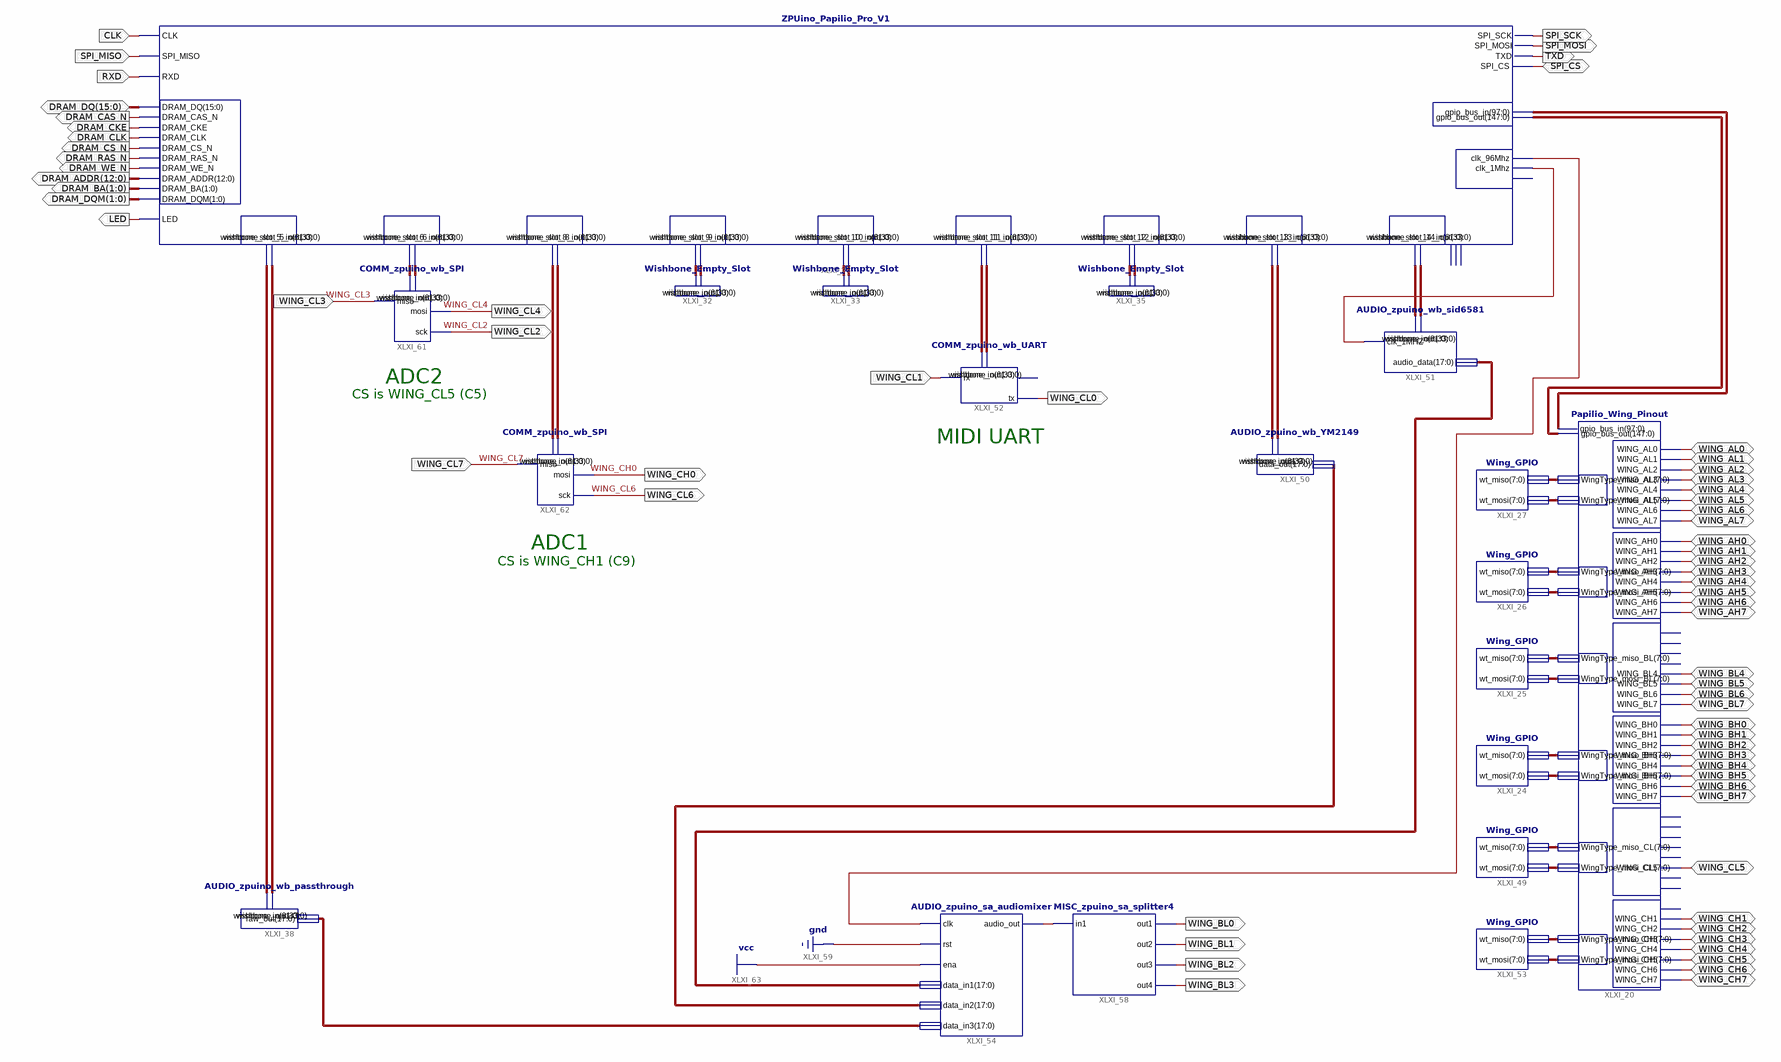
[diagram p0: schematic sheet 1]
// Xilinx ISE schematic Papilio_Pro.sch (spartan6) as structural Verilog: 19 symbols, 66 ports
module Papilio_Pro (
  input  WING_CL3,
  input  WING_CL7,
  input  RXD,
  input  SPI_MISO,
  input  CLK,
  input  WING_CL1,
  inout  WING_AL0,
  inout  WING_AL1,
  inout  WING_AL2,
  inout  WING_AL3,
  inout  WING_AL4,
  inout  WING_AL5,
  inout  WING_AL6,
  inout  WING_AL7,
  inout  WING_AH0,
  inout  WING_AH1,
  inout  WING_AH2,
  inout  WING_AH3,
  inout  WING_AH4,
  inout  WING_AH5,
  inout  WING_AH6,
  inout  WING_AH7,
  inout  WING_BL4,
  inout  WING_BL5,
  inout  WING_BL6,
  inout  WING_BL7,
  inout  WING_BH0,
  inout  WING_BH1,
  inout  WING_BH2,
  inout  WING_BH3,
  inout  WING_BH4,
  inout  WING_BH5,
  inout  WING_BH6,
  inout  WING_BH7,
  inout  WING_CL5,
  inout  WING_CH1,
  inout  WING_CH2,
  inout  WING_CH3,
  inout  WING_CH4,
  inout  WING_CH5,
  inout  WING_CH6,
  inout  WING_CH7,
  inout  [15:0] DRAM_DQ,
  inout  SPI_CS,
  output WING_CL2,
  output WING_CL4,
  output WING_CL6,
  output WING_CH0,
  output DRAM_CAS_N,
  output DRAM_CKE,
  output DRAM_CLK,
  output DRAM_CS_N,
  output DRAM_RAS_N,
  output DRAM_WE_N,
  output [12:0] DRAM_ADDR,
  output [1:0] DRAM_BA,
  output [1:0] DRAM_DQM,
  output LED,
  output TXD,
  output SPI_MOSI,
  output SPI_SCK,
  output WING_CL0,
  output WING_BL0,
  output WING_BL1,
  output WING_BL2,
  output WING_BL3
);

  wire XLXN_504, XLXN_509, XLXN_511;
  wire [7:0] XLXN_329, XLXN_330, XLXN_331, XLXN_332, XLXN_333, XLXN_334, XLXN_335, XLXN_336, XLXN_453,
       XLXN_454, XLXN_471, XLXN_472;
  wire [17:0] XLXN_484, XLXN_514, XLXN_515;
  wire [33:0] XLXN_435, XLXN_439, XLXN_441, XLXN_449, XLXN_474, XLXN_476, XLXN_478, XLXN_518, XLXN_520;
  wire [61:0] XLXN_434, XLXN_438, XLXN_440, XLXN_448, XLXN_473, XLXN_475, XLXN_477, XLXN_517, XLXN_519;
  wire [97:0] XLXN_409;
  wire [147:0] XLXN_408;

  ZPUino_Papilio_Pro_V1 XLXI_28 (
    .gpio_bus_out(XLXN_408), .gpio_bus_in(XLXN_409), .SPI_CS(SPI_CS), .TXD(TXD), .SPI_MOSI(SPI_MOSI),
    .SPI_SCK(SPI_SCK), .clk_96Mhz(XLXN_511), .clk_1Mhz(XLXN_509), .DRAM_DQ(DRAM_DQ), .LED(LED),
    .DRAM_CAS_N(DRAM_CAS_N), .DRAM_CKE(DRAM_CKE), .DRAM_CLK(DRAM_CLK), .DRAM_CS_N(DRAM_CS_N),
    .DRAM_RAS_N(DRAM_RAS_N), .DRAM_WE_N(DRAM_WE_N), .DRAM_ADDR(DRAM_ADDR), .DRAM_BA(DRAM_BA),
    .DRAM_DQM(DRAM_DQM), .CLK(CLK), .SPI_MISO(SPI_MISO), .RXD(RXD), .wishbone_slot_5_out(XLXN_449),
    .wishbone_slot_5_in(XLXN_448), .wishbone_slot_6_in(XLXN_517), .wishbone_slot_6_out(XLXN_518),
    .wishbone_slot_8_in(XLXN_519), .wishbone_slot_8_out(XLXN_520), .wishbone_slot_9_in(XLXN_440),
    .wishbone_slot_9_out(XLXN_441), .wishbone_slot_10_in(XLXN_438), .wishbone_slot_10_out(XLXN_439),
    .wishbone_slot_11_in(XLXN_477), .wishbone_slot_11_out(XLXN_478), .wishbone_slot_12_in(XLXN_434),
    .wishbone_slot_12_out(XLXN_435), .wishbone_slot_13_in(XLXN_473), .wishbone_slot_13_out(XLXN_474),
    .wishbone_slot_14_in(XLXN_475), .wishbone_slot_14_out(XLXN_476));  // open: clk_osc_32Mhz, wishbone_slot_video_in, wishbone_slot_video_out, vgaclkout
  Wishbone_Empty_Slot XLXI_35 (.wishbone_in(XLXN_434), .wishbone_out(XLXN_435));
  Wishbone_Empty_Slot XLXI_33 (.wishbone_in(XLXN_438), .wishbone_out(XLXN_439));
  Wishbone_Empty_Slot XLXI_32 (.wishbone_in(XLXN_440), .wishbone_out(XLXN_441));
  AUDIO_zpuino_wb_passthrough XLXI_38 (.raw_out(XLXN_484), .wishbone_in(XLXN_448), .wishbone_out(XLXN_449));
  AUDIO_zpuino_wb_YM2149 XLXI_50 (.data_out(XLXN_515), .wishbone_in(XLXN_473), .wishbone_out(XLXN_474));
  AUDIO_zpuino_wb_sid6581 XLXI_51 (
    .clk_1MHZ(XLXN_509), .audio_data(XLXN_514), .wishbone_in(XLXN_475), .wishbone_out(XLXN_476));
  COMM_zpuino_wb_UART XLXI_52 (
    .rx(WING_CL1), .wishbone_in(XLXN_477), .wishbone_out(XLXN_478), .tx(WING_CL0));  // open: enabled
  Wing_GPIO XLXI_49 (.wt_miso(XLXN_471), .wt_mosi(XLXN_472));
  Wing_GPIO XLXI_27 (.wt_miso(XLXN_335), .wt_mosi(XLXN_336));
  Wing_GPIO XLXI_26 (.wt_miso(XLXN_333), .wt_mosi(XLXN_334));
  Wing_GPIO XLXI_25 (.wt_miso(XLXN_331), .wt_mosi(XLXN_332));
  Wing_GPIO XLXI_24 (.wt_miso(XLXN_329), .wt_mosi(XLXN_330));
  Papilio_Wing_Pinout XLXI_20 (
    .gpio_bus_out(XLXN_408), .gpio_bus_in(XLXN_409), .WING_AH0(WING_AH0), .WING_AH1(WING_AH1),
    .WING_AH2(WING_AH2), .WING_AH3(WING_AH3), .WING_AH4(WING_AH4), .WING_AH5(WING_AH5), .WING_AH6(WING_AH6),
    .WING_AH7(WING_AH7), .WING_AL0(WING_AL0), .WING_AL1(WING_AL1), .WING_AL2(WING_AL2), .WING_AL3(WING_AL3),
    .WING_AL4(WING_AL4), .WING_AL5(WING_AL5), .WING_AL6(WING_AL6), .WING_AL7(WING_AL7), .WING_BH0(WING_BH0),
    .WING_BH1(WING_BH1), .WING_BH2(WING_BH2), .WING_BH3(WING_BH3), .WING_BH4(WING_BH4), .WING_BH5(WING_BH5),
    .WING_BH6(WING_BH6), .WING_BH7(WING_BH7), .WING_BL4(WING_BL4), .WING_BL5(WING_BL5), .WING_BL6(WING_BL6),
    .WING_BL7(WING_BL7), .WING_CL5(WING_CL5), .WING_CH1(WING_CH1), .WING_CH2(WING_CH2), .WING_CH3(WING_CH3),
    .WING_CH4(WING_CH4), .WING_CH5(WING_CH5), .WING_CH6(WING_CH6), .WING_CH7(WING_CH7),
    .WingType_miso_BH(XLXN_329), .WingType_miso_BL(XLXN_331), .WingType_miso_AH(XLXN_333),
    .WingType_mosi_BL(XLXN_332), .WingType_mosi_BH(XLXN_330), .WingType_mosi_CL(XLXN_472),
    .WingType_mosi_AH(XLXN_334), .WingType_miso_CL(XLXN_471), .WingType_miso_CH(XLXN_453),
    .WingType_mosi_CH(XLXN_454), .WingType_mosi_AL(XLXN_336), .WingType_miso_AL(XLXN_335));  // open: WING_BL0, WING_BL1, WING_BL2, WING_BL3, WING_CL0, WING_CL1, WING_CL2, WING_CL3, WING_CL4, WING_CL6, WING_CL7, WING_CH0
  Wing_GPIO XLXI_53 (.wt_miso(XLXN_453), .wt_mosi(XLXN_454));
  AUDIO_zpuino_sa_audiomixer XLXI_54 (
    .clk(XLXN_511), .rst(1'b0), .ena(1'b1), .data_in1(XLXN_514), .data_in2(XLXN_515), .data_in3(XLXN_484),
    .audio_out(XLXN_504));
  MISC_zpuino_sa_splitter4 XLXI_58 (.in1(XLXN_504), .out1(WING_BL0), .out2(WING_BL1), .out3(WING_BL2), .out4(WING_BL3));
  COMM_zpuino_wb_SPI XLXI_61 (
    .miso(WING_CL3), .sck(WING_CL2), .mosi(WING_CL4), .wishbone_in(XLXN_517), .wishbone_out(XLXN_518));
  COMM_zpuino_wb_SPI XLXI_62 (
    .miso(WING_CL7), .sck(WING_CL6), .mosi(WING_CH0), .wishbone_in(XLXN_519), .wishbone_out(XLXN_520));

  // Notes on the sheet:
  //   ADC2
  //   CS is WING_CL5 (C5)
  //   MIDI UART
  //   ADC1
  //   CS is WING_CH1 (C9)
endmodule
